# Altium schematic sheet MICROPHONE.SchDoc: =DocumentName
size B; SheetNumber: 8; SheetTotal: 8
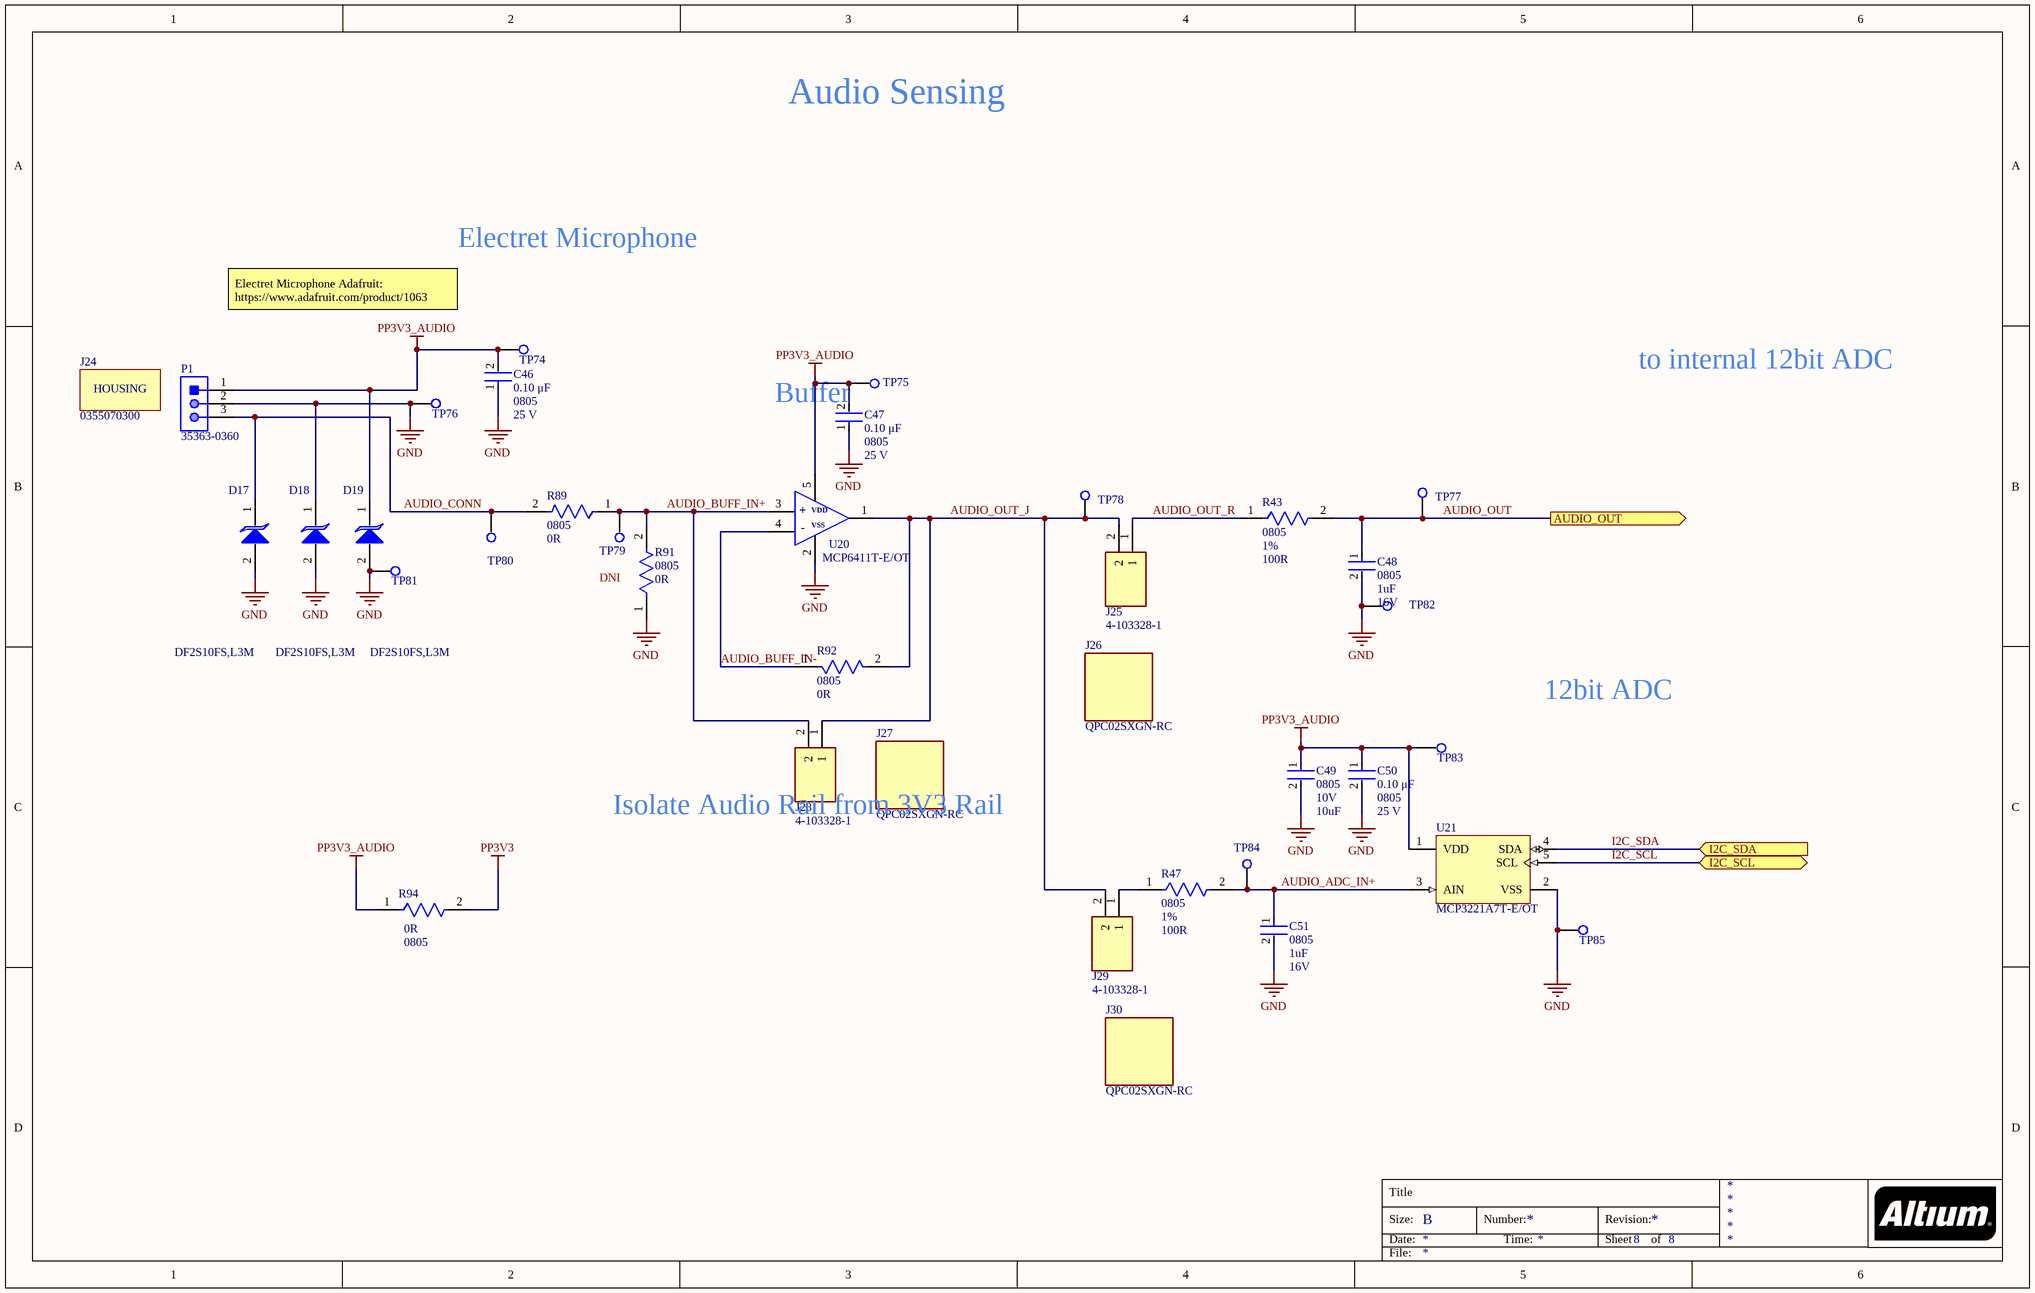
[diagram p0: MICROPHONE.SchDoc]

## Parts
C46  Capacitance: 0.10 μF  Package: 0805  Voltage Rating: 25 V  [FP-C0805C-DN-IPC_B]  (hidden comment: C0805C104M3RACTU)
C47  Capacitance: 0.10 μF  Package: 0805  Voltage Rating: 25 V  [FP-C0805C-DN-IPC_B]  (hidden comment: C0805C104M3RACTU)
C48  Case/Package: 0805  Capacitance: 1uF  Voltage: 16V  [FP-CL21-IPC_A]  (hidden comment: CL21B105KOFNNNE)
C49  Case/Package: 0805  Voltage Rating (DC): 10V  Capacitance: 10uF  [FP-GRM21B-0_15-IPC_A]  (hidden comment: GRM21BR71A106KA73K)
C50  Capacitance: 0.10 μF  Package: 0805  Voltage Rating: 25 V  [FP-C0805C-DN-IPC_B]  (hidden comment: C0805C104M3RACTU)
C51  Case/Package: 0805  Capacitance: 1uF  Voltage: 16V  [FP-CL21-IPC_A]  (hidden comment: CL21B105KOFNNNE)
D17  DF2S10FS,L3M  [DIOM106X45N]
D18  DF2S10FS,L3M  [DIOM106X45N]
D19  DF2S10FS,L3M  [DIOM106X45N]
J24  0355070300
J25  4-103328-1  [TE_4-103328-1]
J26  QPC02SXGN-RC  [FP-QPC02SXGN-RC-MFG]
J27  QPC02SXGN-RC  [FP-QPC02SXGN-RC-MFG]
J28  4-103328-1  [TE_4-103328-1]
J29  4-103328-1  [TE_4-103328-1]
J30  QPC02SXGN-RC  [FP-QPC02SXGN-RC-MFG]
P1  35363-0360  [MOLX-35363-0360_V]
R43  Case Code (Imperial): 0805  Tolerance: 1%  Resistance: 100R  [FP-RMCF0805-IPC_A]  (hidden comment: RMCF0805FT100R)
R47  Case Code (Imperial): 0805  Tolerance: 1%  Resistance: 100R  [FP-RMCF0805-IPC_A]  (hidden comment: RMCF0805FT100R)
R89  Case/Package: 0805  Resistance: 0R  [FP-RMCF0805-MFG]  (hidden comment: RMCF0805ZT0R00)
R91  Case/Package: 0805  Resistance: 0R  [FP-RMCF0805-MFG]  (hidden comment: RMCF0805ZT0R00)
R92  Case/Package: 0805  Resistance: 0R  [FP-RMCF0805-MFG]  (hidden comment: RMCF0805ZT0R00)
R94  Case/Package: 0805  Resistance: 0R  [FP-RMCF0805-MFG]  (hidden comment: RMCF0805ZT0R00)
TP74  RCU-0C  [TP+195X110]  (value not drawn)
TP75  RCU-0C  [TP+195X110]  (value not drawn)
TP76  RCU-0C  [TP+195X110]  (value not drawn)
TP77  RCU-0C  [TP+195X110]  (value not drawn)
TP78  RCU-0C  [TP+195X110]  (value not drawn)
TP79  RCU-0C  [TP+195X110]  (value not drawn)
TP80  RCU-0C  [TP+195X110]  (value not drawn)
TP81  RCU-0C  [TP+195X110]  (value not drawn)
TP82  RCU-0C  [TP+195X110]  (value not drawn)
TP83  RCU-0C  [TP+195X110]  (value not drawn)
TP84  RCU-0C  [TP+195X110]  (value not drawn)
TP85  RCU-0C  [TP+195X110]  (value not drawn)
U20  MCP6411T-E/OT  [SOT95P280X145-5N]
U21  MCP3221A7T-E/OT  [SOT-23-OT5_M]

## Ports
AUDIO_OUT (out), I2C_SCL (bidir), I2C_SDA (in)

## Nets
GND: C46.1 C47.1 C48.2 C49.2 C50.2 C51.2 D17.2(A) D18.1(K) D18.2(A) D19.2(A) P1.2 R91.1 TP76.1 TP81.1 TP82.1 TP85.1 U20.2(VSS) U21.2(VSS)
PP3V3: R94.2
PP3V3_AUDIO: C46.2 C47.2 C49.1 C50.1 D19.1(K) P1.1 R94.1 TP74.1 TP75.1 TP83.1 U20.5(VDD) U21.1(VDD)
AUDIO_ADC_IN+: C51.1 R47.2 TP84.1 U21.3(AIN)
AUDIO_BUFF_IN+: J28.2 R89.1 R91.2 TP79.1 U20.3(VIN+)
AUDIO_BUFF_IN-: R92.1 U20.4(VIN-)
AUDIO_CONN: D17.1(K) P1.3 R89.2 TP80.1
AUDIO_OUT: C48.1 R43.2 TP77.1 ; port AUDIO_OUT
AUDIO_OUT_J: J25.2 J28.1 J29.2 R92.2 TP78.1 U20.1(VOUT)
AUDIO_OUT_R: J25.1 R43.1
I2C_SCL: U21.5(SCL) ; port I2C_SCL
I2C_SDA: U21.4(SDA) ; port I2C_SDA
NetJ29_1: J29.1 R47.1

## Notes on the sheet
- Audio Sensing
- Electret Microphone
- Electret Microphone Adafruit: https://www.adafruit.com/product/1063
- to internal 12bit ADC
- Buffer
- DNI
- (near TP83) 12bit ADC
- Isolate Audio Rail from 3V3 Rail
- Title
- Size:
- Date:
- B
- Number:
- Time:
- Revision:
- Sheet
- of
- File:
- (in symbol 0355070300) HOUSING
- (in symbol MCP6411T-E_OT) +; -

## Library data of the parts
C46 C47 C50 = CMP-2007-00282-2: CAP CER 0.1UF 25V 20% X7R 0805; Manufacturer: KEMET; Temperature Coefficient: 30ppm/°C; Material: Ceramic; Tolerance: 0.2; Value: 0.10 μF; Digikey Description: CAP CER 0.1UF 25V 20% X7R 0805; Device Class L2: Capacitors; Temperature: -55°C to +125°C; Device Class L1: Passive Components; ComponentLink2Description: Datasheet; Mouser Description: Multilayer Ceramic Capacitors MLCC - SMD/SMT 25volts 0.1uF X7R 20%; Temperature Range High: +125°C; Device Class L3: Ceramic Capacitors; Automotive: No; Temperature Range Low: -55°C; RoHS: TRUE; Category: Cap; Lead Free: Yes; Ipc Land Pattern Name: CAPC200125X78; Height: 0.88mm; Temperature Characteristic: X7R; Octopart: https://octopart.com/c0805c104m3ractu-kemet-9138612; ComponentLink2URL: https://content.kemet.com/datasheets/KEM_C1003_C0G_SMD.pdf; Manufacturer Part Number: C0805C104M3RACTU; Supplier: Digi-Key; Supplier Part Number: 399-C0805C104M3RAC7800CT-ND
C48 C51 = CMP-13271-003098-1: CL21 Series 0805 1uF 16V ±10% Tolerance X7R Multilayer Ceramic Chip Capacitor; Manufacturer: Samsung Electro-Mechanics; Width: 0.049inch; Thickness: 0.053inch; Voltage Rating: 16V; Max Operating Temperature: 125°C; Case Code (Imperial): 0805; Height: 1.25mm; Length: 2mm; Lead Free: Lead Free; Mount: Surface Mount; Tolerance: 10%; Voltage Rating (DC): 16V; Min Operating Temperature: -55°C; Contact Plating: Tin; Depth: 1.25mm; Packaging: Tape and Reel; Package Quantity: 1; Dielectric: X7R; Radiation Hardening: No; Case Code (Metric): 2012; Manufacturer Part Number: CL21B105KOFNNNE; Supplier: Digi-Key; Supplier Part Number: 1276-1026-1-ND
C49 = CMP-06035-038134-1: Chip Multilayer Ceramic Capacitors for General Purpose, 0805, 10uF, X7R, 15%, 10%, 10V; Manufacturer: Murata Electronics; Dielectric: X7R; Thickness: 1.25mm; Tolerance: 10%; Length: 2mm; Width: 1.25mm; Manufacturer Part Number: GRM21BR71A106KA73K; Supplier Part Number: 490-14381-1-ND; Supplier: Digi-Key
D17-D19 = DF2S10FS,L3M: TVS DIODE 8VWM FSC; Manufacturer_Name: Toshiba; Manufacturer: Toshiba Semiconductor and Storage; Datasheet Link: https://componentsearchengine.com/Datasheets/1/DF2S10FS,L3M.pdf; Height: 0.45mm; Manufacturer_Part_Number: DF2S10FS,L3M; Mouser Part Number: 757-DF2S10FSL3M; Mouser Price/Stock: https://www.mouser.co.uk/ProductDetail/Toshiba/DF2S10FSL3M?qs=lhkzy8lC%252BSsM5fAm2E7mCQ%3D%3D; Arrow Part Number: DF2S10FS,L3M; Arrow Price/Stock: https://www.arrow.com/en/products/df2s10fsl3m/toshiba?region=nac; Manufacturer Part Number: DF2S10FS,L3M; Supplier: Digi-Key; Supplier Part Number: DF2S10FSL3MCT-ND
J24 = 0355070300: Manufacturer: Molex; Manufacturer Part Number: 0355070300; Supplier: Digi-Key; Supplier Part Number: WM5982-ND
J25 J28 J29 = 4-103328-1: Connector Header Through Hole 2 position; Manufacturer: TE Connectivity AMP Connectors; MF: TE Connectivity; SnapEDA_Link: https://www.snapeda.com/parts/4-103328-1/TE%20Connectivity%20AMP%20Connectors/view-part/2384420/?ref=snap; MP: 4-103328-1; TE_purchase_URL: https://www.te.com/usa-en/product-4-103328-1.html?te_bu=Cor&te_type=disp&te_campaign=seda_glo_cor-seda-global-disp-prtnr-fy19-seda-model-bom-cta_sma-317_1&elqCampaignId=32493; Availability: Unavailable; Value: *; EU_RoHS_Compliance: Compliant; Price: None; Package: None; Supplier: Digi-Key; Supplier Part Number: A121364-ND; Manufacturer Part Number: 4-103328-1
J26 J27 J30 = CMP-25666-000001-1: CONN JUMPER SHORTING .100" GOLD; Manufacturer: Sullins; Conn Orientation: Straight; Pitch: 2.54mm; Current Rating: 3A; Number Of Contacts: 2; Category: Conn; Temperature Range Low: -40°C; Temperature Range High: +85°C; Device Class L1: Connectors; Lead Free: Yes; Manufacturer Part Number: QPC02SXGN-RC; Automotive: No; Height: 6.17mm; ComponentLink2URL: https://s3.amazonaws.com/catalogspreads-pdf/PAGE128-129%20.100%20JUMPER.pdf; Device Class L2: unset; Footprint Url: https://drawings-pdf.s3.amazonaws.com/11510.pdf; Device Class L3: unset; Temperature: -40°C to +85°C; RoHS: TRUE; Digikey Description: CONN JUMPER SHORTING .100" GOLD; Octopart: https://octopart.com/qpc02sxgn-rc-sullins-19878795; Package: 0; ComponentLink2Description: Datasheet; Contact Material: Gold; Supplier: Digi-Key; Supplier Part Number: S9337-ND
P1 = CMP-2000-05595-1: Male Header, Pitch 2 mm, 1 x 3 Position, Height 5.5 mm, Tail Length 3.2 mm, -40 to 105 degC, RoHS, Bulk; Manufacturer: Molex; Manufacturer Part Number: 0353630360; Gender: HDR; Pitch: 2mm; Number of Contacts: 3; Datasheet Version: Rev. G, 01/2012; Package Description: Male Header, Pitch 2 mm, 1 x 3 Position, Height 5.5 mm, Tail Length 3.2 mm; Datasheet URL: http://www.molex.com/pdm_docs/sd/353630360_sd.pdf; Termination Method: Solder; Category: ConnectorHeadersandPCBReceptacles; Number of Rows: 1; Manufacturer URL: http://www.molex.com/; Type: WiretoBoard; Mounting Technology: ThroughHole; Package Reference: 35363-0360; Supplier: Digi-Key; Supplier Part Number: WM18932-ND
R43 R47 = CMP-26527-001731-1: 100Ω ±1% 0.125W 0805 Thick Film Chip Resistor AEC-Q200 compliant; Manufacturer: Stackpole Electronics Inc; Power Rating: 250mW; Temperature Coefficient: 100ppm/°C; Max Power Dissipation: 125mW; Radiation Hardening: No; RoHS Compliant: Yes; Depth: 1.25mm; Length: 2mm; Min Operating Temperature: -55°C; Series: RMCF; Packaging: Tape and Reel; Features: Automotive AEC-Q200; Height: 0.026inch; Size Code: 0805; Number of Terminations: 2; Max Operating Temperature: 155°C; Case/Package: 0805; Width: 0.049inch; Contact Plating: Tin; Resistor Type: Thick Film; Construction: Rectangular; Lead Free: Lead Free; Military Standard: Not; Case Code (Metric): 2012; Mount: Surface Mount; Manufacturer Part Number: RMCF0805FT100R; Supplier: Digi-Key; Supplier Part Number: RMCF0805FT100RCT-ND
R89 R91 R92 R94 = CMP-26527-000017-1: RES 0 OHM JUMPER 1/8W 0805; Manufacturer: Stackpole Electronics Inc; Power Rating: 125mW; Depth: 1.25mm; Length: 2mm; Military Standard: Not; Width: 0.049inch; Case Code (Imperial): 0805; Number of Terminations: 2; Mount: Surface Mount; Contact Plating: Tin; Height: 0.026inch; Min Operating Temperature: -55°C; Composition: Thick Film; Max Operating Temperature: 155°C; Packaging: Tape and Reel; Features: Automotive AEC-Q200; Max Power Dissipation: 125mW; Radiation Hardening: No; Lead Free: Lead Free; Case Code (Metric): 2012; Supplier: Digi-Key; Supplier Part Number: RMCF0805ZT0R00CT-ND; Manufacturer Part Number: RMCF0805ZT0R00
TP74-TP85 = RCU-0C: Natural PC Test Point , Plating Surface Mount Mounting Type; Manufacturer: TE Connectivity AMP Connectors; Value: *; Package: SON-6 TE Connectivity AMP Connectors; Purchase-URL: https://pricing.snapeda.com/search/part/RCU-0C/?ref=eda; Supplier Part Number: A106145CT-ND; Check_prices: https://www.snapeda.com/parts/RCU-0C/TE%20Connectivity/view-part/4791537/?ref=eda; Manufacturer Part Number: RCU-0C; SnapEDA_Link: https://www.snapeda.com/parts/RCU-0C/TE%20Connectivity/view-part/4791537/?ref=snap; Supplier: Digi-Key
U20 = MCP6411T-E_OT: IC OPAMP GP 1 CIRCUIT SOT23-5; Manufacturer: Microchip; Datasheet Link: http://ww1.microchip.com/downloads/en/DeviceDoc/20005791B.pdf; Height: 1.45mm; Manufacturer Part Number: MCP6411T-E/OT; Mouser Part Number: 579-MCP6411T-E/OT; Mouser Price/Stock: https://www.mouser.com/Search/Refine.aspx?Keyword=579-MCP6411T-E%2FOT; Arrow Part Number: MCP6411T-E/OT; Arrow Price/Stock: https://www.arrow.com/en/products/mcp6411t-eot/microchip-technology; Supplier: Digi-Key; Supplier Part Number: MCP6411T-E/OTCT-ND
U21 = MCP3221A7T-E/OT: Low Power 12-Bit A/D Converter With I2C Interface, 5-Pin SOT-23, Extended Temperature, Tape and Reel; Manufacturer: Microchip Technology; ComponentLink1Description: Manufacturer URL; ComponentLink2URL: http://ww1.microchip.com/downloads/en/DeviceDoc/21732c.pdf; RevisionNote: URLs added.; ComponentLink3URL: http://www.microchip.com/stellent/groups/techpub_sg/documents/packagingspec/en012702.pdf; Code_IPC: SOT23-5; ComponentLink3Description: Package Specification; ComponentLink1URL: http://www.microchip.com/; PackageVersion: revBB, Aug-2009; PackageReference: SOT-23-OT5; ComponentLink2Description: Datasheet; DatasheetVersion: revC, Jul-2006; PackageDescription: 5-Lead Plastic Small Outline Transistor (OT) [SOT-23]; Manufacturer Part Number: MCP3221A7T-E/OT; Supplier: Digi-Key; Supplier Part Number: MCP3221A7T-E/OTCT-ND